# Altium schematic sheet ui-pcb.SchDoc
size A4; SheetNumber: 1; SheetTotal: 8
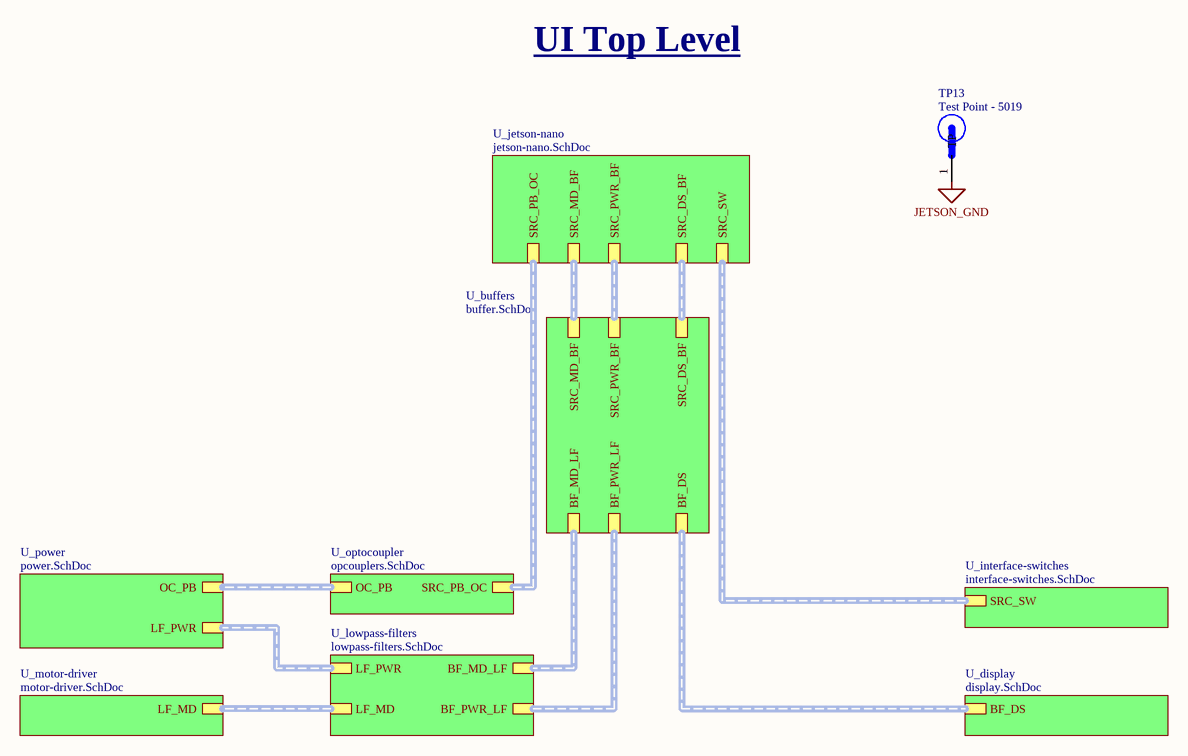
[diagram p0: ui-pcb.SchDoc]

## Parts
TP13  Test Point - 5019  [TP380X203]

## Sub-sheets
U_buffers = buffer.SchDoc: SRC_MD_BF (harness MD_SIGNALS), SRC_PWR_BF (harness PWR_SIGNALS), SRC_DS_BF (harness DS_SIGNALS), BF_MD_LF (harness MD_SIGNALS), BF_PWR_LF (harness PWR_SIGNALS), BF_DS (harness DS_SIGNALS)
U_display = display.SchDoc: BF_DS (harness DS_SIGNALS)
U_interface-switches = interface-switches.SchDoc: SRC_SW (harness SW_SIGNALS)
U_jetson-nano = jetson-nano.SchDoc: SRC_DS_BF (harness DS_SIGNALS), SRC_PWR_BF (harness PWR_SIGNALS), SRC_MD_BF (harness MD_SIGNALS), SRC_SW (harness SW_SIGNALS), SRC_PB_OC (harness PB_SIGNALS)
U_lowpass-filters = lowpass-filters.SchDoc: BF_PWR_LF (harness PWR_SIGNALS), LF_PWR (harness PWR_SIGNALS), BF_MD_LF (harness MD_SIGNALS), LF_MD (harness MD_SIGNALS)
U_motor-driver = motor-driver.SchDoc: LF_MD (harness MD_SIGNALS)
U_optocoupler = opcouplers.SchDoc: OC_PB (harness PB_SIGNALS), SRC_PB_OC (harness PB_SIGNALS)
U_power = power.SchDoc: LF_PWR (harness PWR_SIGNALS), OC_PB (harness PB_SIGNALS)

## Nets
JETSON_GND: TP13.1(TP)

## Buses and harness runs
harness sheet U_buffers/BF_DS = sheet U_display/BF_DS
harness sheet U_buffers/BF_MD_LF = sheet U_lowpass-filters/BF_MD_LF
harness sheet U_buffers/BF_PWR_LF = sheet U_lowpass-filters/BF_PWR_LF
harness sheet U_buffers/SRC_DS_BF = sheet U_jetson-nano/SRC_DS_BF
harness sheet U_buffers/SRC_MD_BF = sheet U_jetson-nano/SRC_MD_BF
harness sheet U_buffers/SRC_PWR_BF = sheet U_jetson-nano/SRC_PWR_BF
harness sheet U_interface-switches/SRC_SW = sheet U_jetson-nano/SRC_SW
harness sheet U_jetson-nano/SRC_PB_OC = sheet U_optocoupler/SRC_PB_OC
harness sheet U_lowpass-filters/LF_MD = sheet U_motor-driver/LF_MD
harness sheet U_lowpass-filters/LF_PWR = sheet U_power/LF_PWR
harness sheet U_optocoupler/OC_PB = sheet U_power/OC_PB

## Notes on the sheet
- UI Top Level

## Library data of the parts
TP13 = Test Point - 5019: PC Test Point, Miniature Phosphor Bronze, Silver Plating Surface Mount Mounting Type; MP: 5019; MF: Keystone Electronics; Value: *; Package: 2010 Keystone; Part Number: Test Point - 5019